# EasyEDA schematic easyeda.json
TITLE: jem1427-gpio-ts; REV: 1.0; Date: 2022-03-26; Sheet: 1/1; Drawn By: Aki
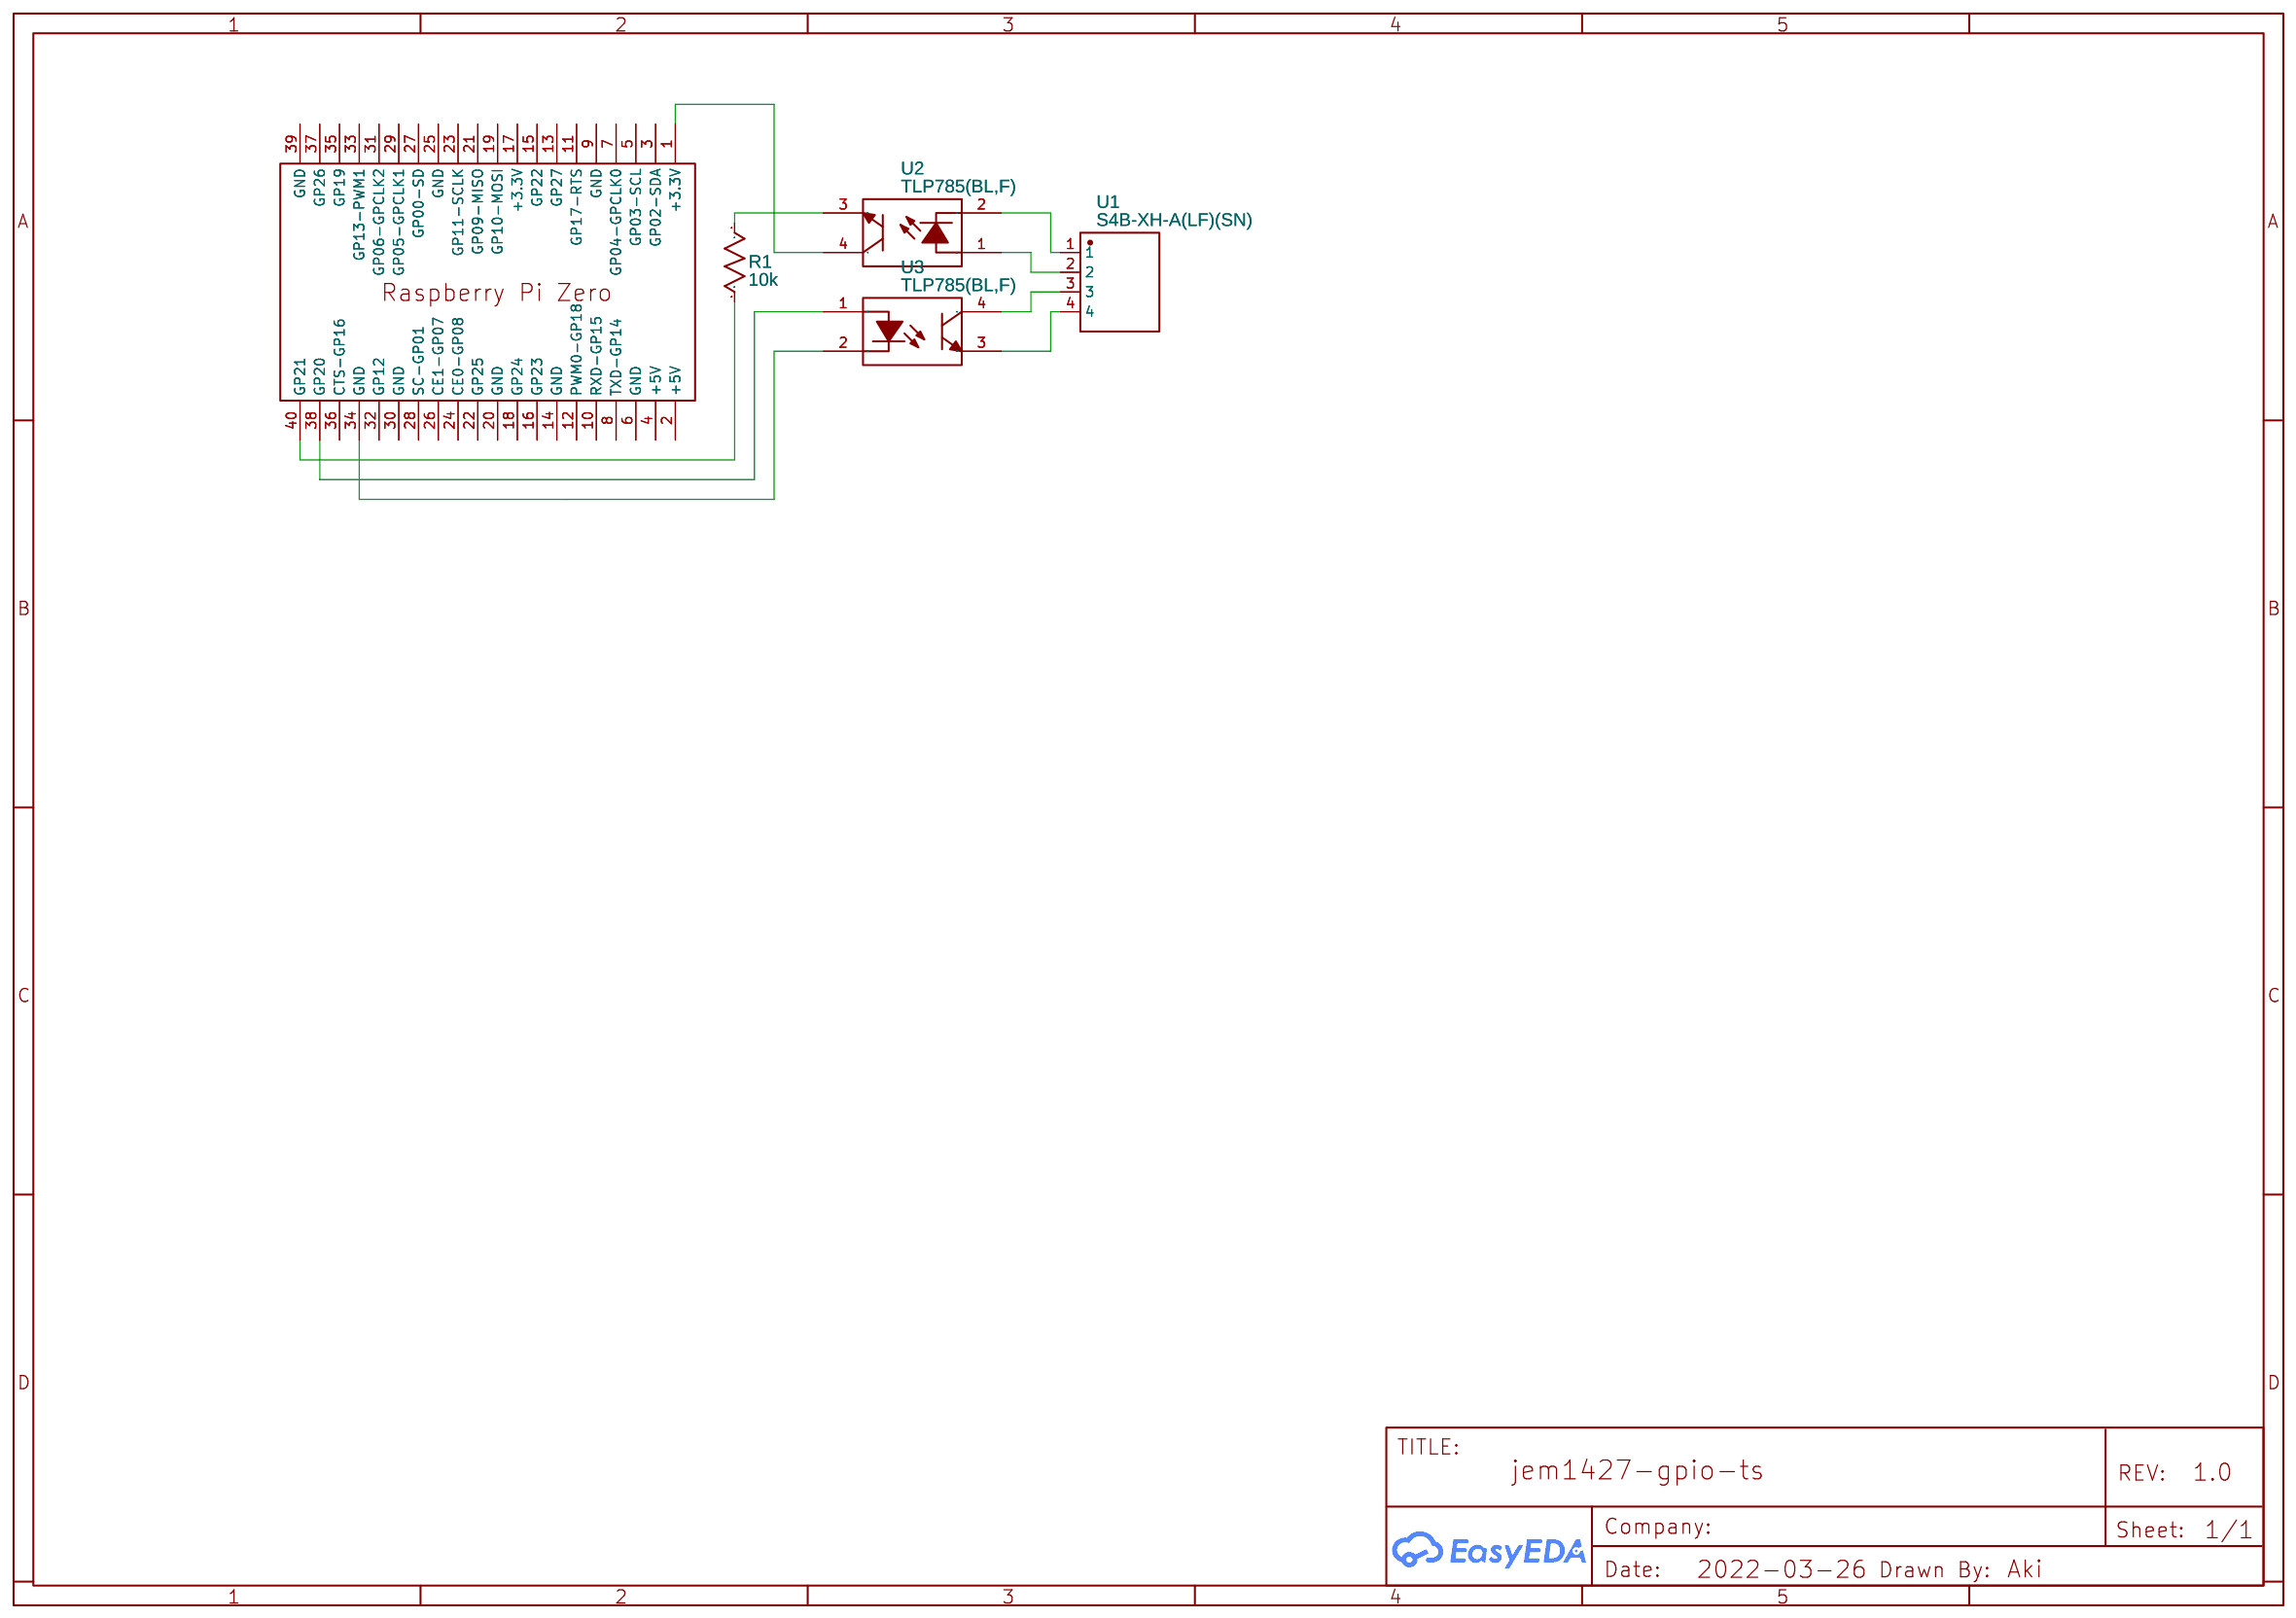
[diagram p0: schematic sheet]

## Parts
R1  10k  [R0201]
RPI1  Raspberry Pi Zero  [RASPBERRY_PI_ZERO]
U1  S4B-XH-A(LF)(SN)  [CONN-TH_B4B-XH-A-LF-SN]
U2  TLP785(BL,F)  [DIP-4_L4.6-W6.5-P2.54-LS7.6-BL]
U3  TLP785(BL,F)  [DIP-4_L4.6-W6.5-P2.54-LS7.6-BL]

## Library data of the parts
R1 = R_0201_US: Contributor: LCEDA_Lib
RPI1 = Raspberry Pi Zero: Contributor: microelectronix6; sourceId: XYSa4mEWQ; Manufacturer Part: Raspberry Pi Zero WH; Supplier: Pollin; Supplier Part: 810885; Manufacturer: Raspberry Pi Foundation; link: https://www.pollin.de/p/raspberry-pi-zero-wh-mit-bestuecktem-header-810885
U1 = B4B-XH-A(LF)(SN): Supplier: LCSC; Supplier Part: C144395; Manufacturer: JST Sales America; Contributor: LCSC; JLCPCB Part Class: Extended Part
U2 U3 = TLP785(BL,F): Supplier: LCSC; Manufacturer: TOSHIBA; Contributor: LCSC; Supplier Part: C115022; JLCPCB Part Class: Extended Part

## Nets
Net-(R1-1): R1.1 U2.3
Net-(R1-2): R1.2 RPI1.40(GP21)
Net-(RPI1-1): RPI1.1(+3.3V) U2.4
Net-(RPI1-34): RPI1.34(GND) U3.2
Net-(RPI1-38): RPI1.38(GP20) U3.1
Net-(U1-1): U1.1 U2.2
Net-(U1-2): U1.2 U2.1
Net-(U1-3): U1.3 U3.4
Net-(U1-4): U1.4 U3.3

Not connected (* = marked no-connect by the designer): RPI1 2(+5V) 3(GP02-SDA) 4(+5V) 5(GP03-SCL) 6(GND) 7(GP04-GPCLK0) 8(TXD-GP14) 9(GND) 10(RXD-GP15) 11(GP17-RTS) 12(PWM0-GP18) 13(GP27) 14(GND) 15(GP22) 16(GP23) 17(+3.3V) 18(GP24) 19(GP10-MOSI) 20(GND) 21(GP09-MISO) 22(GP25) 23(GP11-SCLK) 24(CE0-GP08) 25(GND) 26(CE1-GP07) 27(GP00-SD) 28(SC-GP01) 29(GP05-GPCLK1) 30(GND) 31(GP06-GPCLK2) 32(GP12) 33(GP13-PWM1) 35(GP19) 36(CTS-GP16) 37(GP26) 39(GND)
